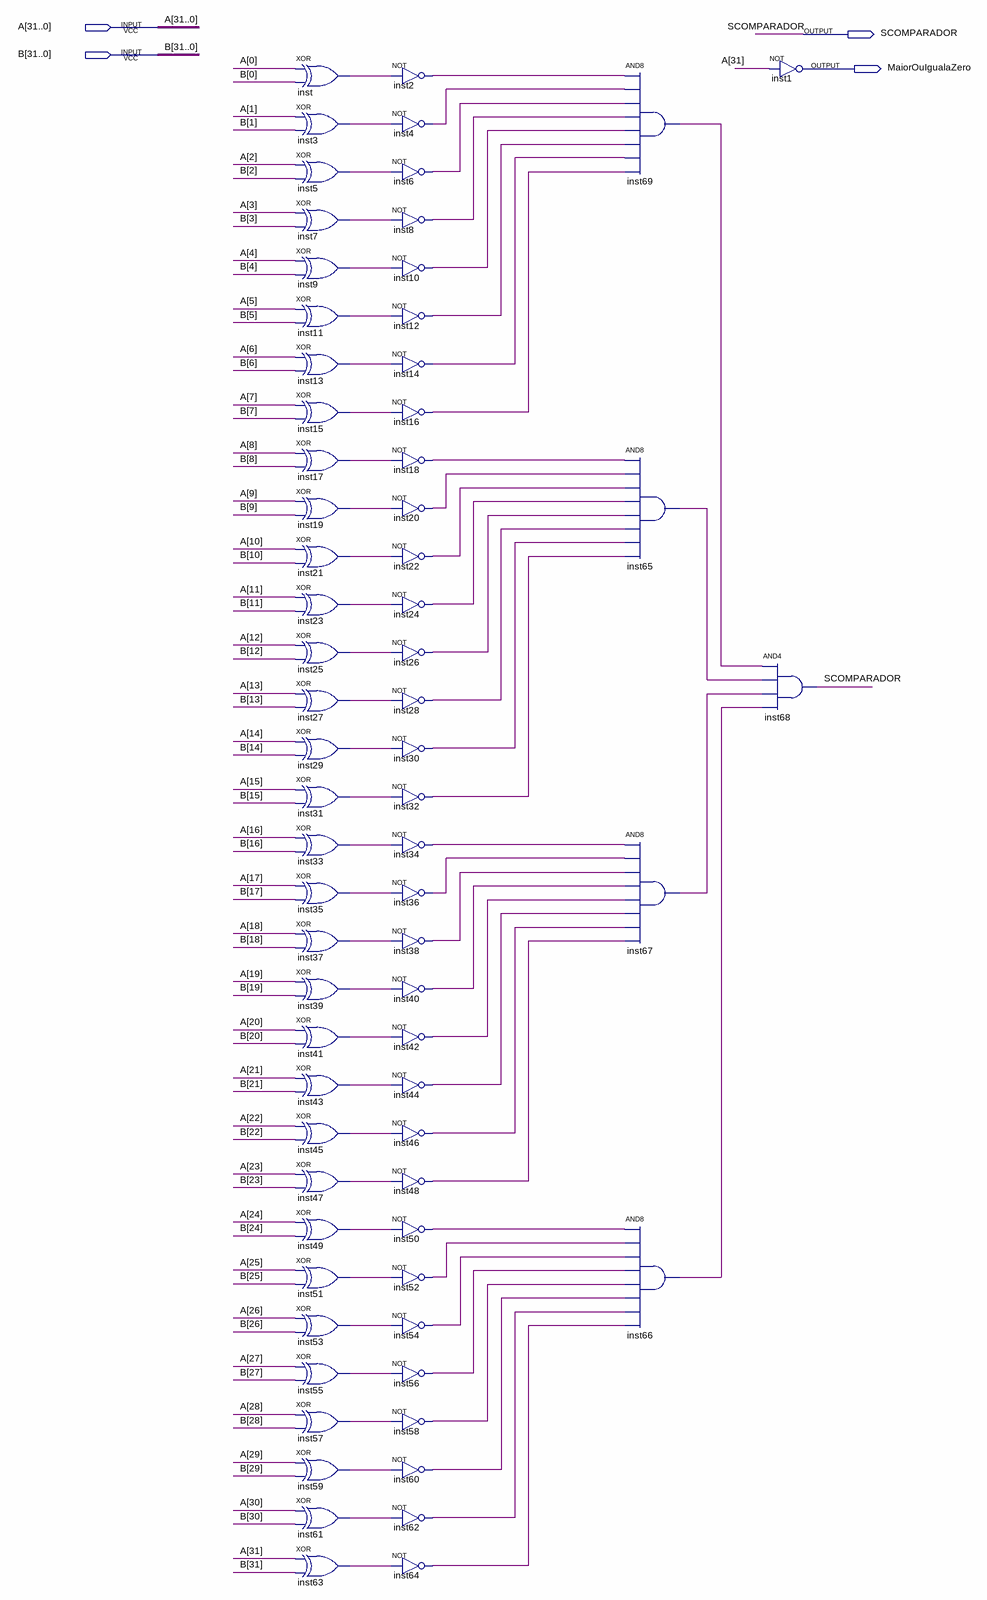
[diagram p0: schematic sheet]
// Quartus schematic COMPARADOR.bdf as structural Verilog: 70 symbols, 4 pins
module COMPARADOR (
  input  [31:0] A,
  input  [31:0] B,
  output SCOMPARADOR,
  output MaiorOuIgualaZero
);

  wire inst2_out, inst3_out, inst4_out, inst5_out, inst6_out, inst7_out, inst8_out, inst9_out, inst10_out,
       inst11_out, inst12_out, inst13_out, inst14_out, inst15_out, inst16_out, inst17_out, inst18_out,
       inst19_out, inst20_out, inst21_out, inst22_out, inst23_out, inst24_out, inst25_out, inst26_out,
       inst27_out, inst28_out, inst29_out, inst30_out, inst31_out, inst32_out, inst33_out, inst34_out,
       inst35_out, inst36_out, inst37_out, inst38_out, inst39_out, inst40_out, inst41_out, inst42_out,
       inst43_out, inst44_out, inst45_out, inst46_out, inst47_out, inst48_out, inst49_out, inst50_out,
       inst51_out, inst52_out, inst53_out, inst54_out, inst55_out, inst56_out, inst57_out, inst58_out,
       inst59_out, inst60_out, inst61_out, inst62_out, inst63_out, inst64_out, inst65_out, inst66_out,
       inst67_out, inst69_out, inst_out;

  xor inst (inst_out, A[0], B[0]);
  xor inst3 (inst3_out, A[1], B[1]);
  xor inst5 (inst5_out, A[2], B[2]);
  xor inst7 (inst7_out, A[3], B[3]);
  xor inst9 (inst9_out, A[4], B[4]);
  xor inst11 (inst11_out, A[5], B[5]);
  xor inst13 (inst13_out, A[6], B[6]);
  xor inst15 (inst15_out, A[7], B[7]);
  xor inst17 (inst17_out, A[8], B[8]);
  xor inst19 (inst19_out, A[9], B[9]);
  xor inst21 (inst21_out, A[10], B[10]);
  xor inst23 (inst23_out, A[11], B[11]);
  xor inst25 (inst25_out, A[12], B[12]);
  xor inst27 (inst27_out, A[13], B[13]);
  xor inst29 (inst29_out, A[14], B[14]);
  xor inst31 (inst31_out, A[15], B[15]);
  xor inst33 (inst33_out, A[16], B[16]);
  xor inst35 (inst35_out, A[17], B[17]);
  xor inst37 (inst37_out, A[18], B[18]);
  xor inst39 (inst39_out, A[19], B[19]);
  xor inst41 (inst41_out, A[20], B[20]);
  xor inst43 (inst43_out, A[21], B[21]);
  xor inst45 (inst45_out, A[22], B[22]);
  xor inst47 (inst47_out, A[23], B[23]);
  xor inst49 (inst49_out, A[24], B[24]);
  xor inst51 (inst51_out, A[25], B[25]);
  xor inst53 (inst53_out, A[26], B[26]);
  xor inst55 (inst55_out, A[27], B[27]);
  xor inst57 (inst57_out, A[28], B[28]);
  xor inst59 (inst59_out, A[29], B[29]);
  xor inst61 (inst61_out, A[30], B[30]);
  xor inst63 (inst63_out, A[31], B[31]);
  not inst2 (inst2_out, inst_out);
  not inst4 (inst4_out, inst3_out);
  not inst6 (inst6_out, inst5_out);
  not inst8 (inst8_out, inst7_out);
  not inst10 (inst10_out, inst9_out);
  not inst12 (inst12_out, inst11_out);
  not inst14 (inst14_out, inst13_out);
  not inst16 (inst16_out, inst15_out);
  not inst18 (inst18_out, inst17_out);
  not inst20 (inst20_out, inst19_out);
  not inst22 (inst22_out, inst21_out);
  not inst24 (inst24_out, inst23_out);
  not inst26 (inst26_out, inst25_out);
  not inst28 (inst28_out, inst27_out);
  not inst30 (inst30_out, inst29_out);
  not inst32 (inst32_out, inst31_out);
  not inst34 (inst34_out, inst33_out);
  not inst36 (inst36_out, inst35_out);
  not inst38 (inst38_out, inst37_out);
  not inst40 (inst40_out, inst39_out);
  not inst42 (inst42_out, inst41_out);
  not inst44 (inst44_out, inst43_out);
  not inst46 (inst46_out, inst45_out);
  not inst48 (inst48_out, inst47_out);
  not inst50 (inst50_out, inst49_out);
  not inst52 (inst52_out, inst51_out);
  not inst54 (inst54_out, inst53_out);
  not inst56 (inst56_out, inst55_out);
  not inst58 (inst58_out, inst57_out);
  not inst60 (inst60_out, inst59_out);
  not inst62 (inst62_out, inst61_out);
  not inst64 (inst64_out, inst63_out);
  and inst69 (inst69_out, inst2_out, inst4_out, inst6_out, inst8_out, inst10_out, inst12_out, inst14_out, inst16_out);
  and inst65 (inst65_out, inst18_out, inst20_out, inst22_out, inst24_out, inst26_out, inst28_out, inst30_out, inst32_out);
  and inst67 (inst67_out, inst34_out, inst36_out, inst38_out, inst40_out, inst42_out, inst44_out, inst46_out, inst48_out);
  and inst66 (inst66_out, inst50_out, inst52_out, inst54_out, inst56_out, inst58_out, inst60_out, inst62_out, inst64_out);
  not inst1 (MaiorOuIgualaZero, A[31]);
  and inst68 (SCOMPARADOR, inst69_out, inst65_out, inst67_out, inst66_out);
endmodule
